# Altium project AFLC Board V1.PrjPcb
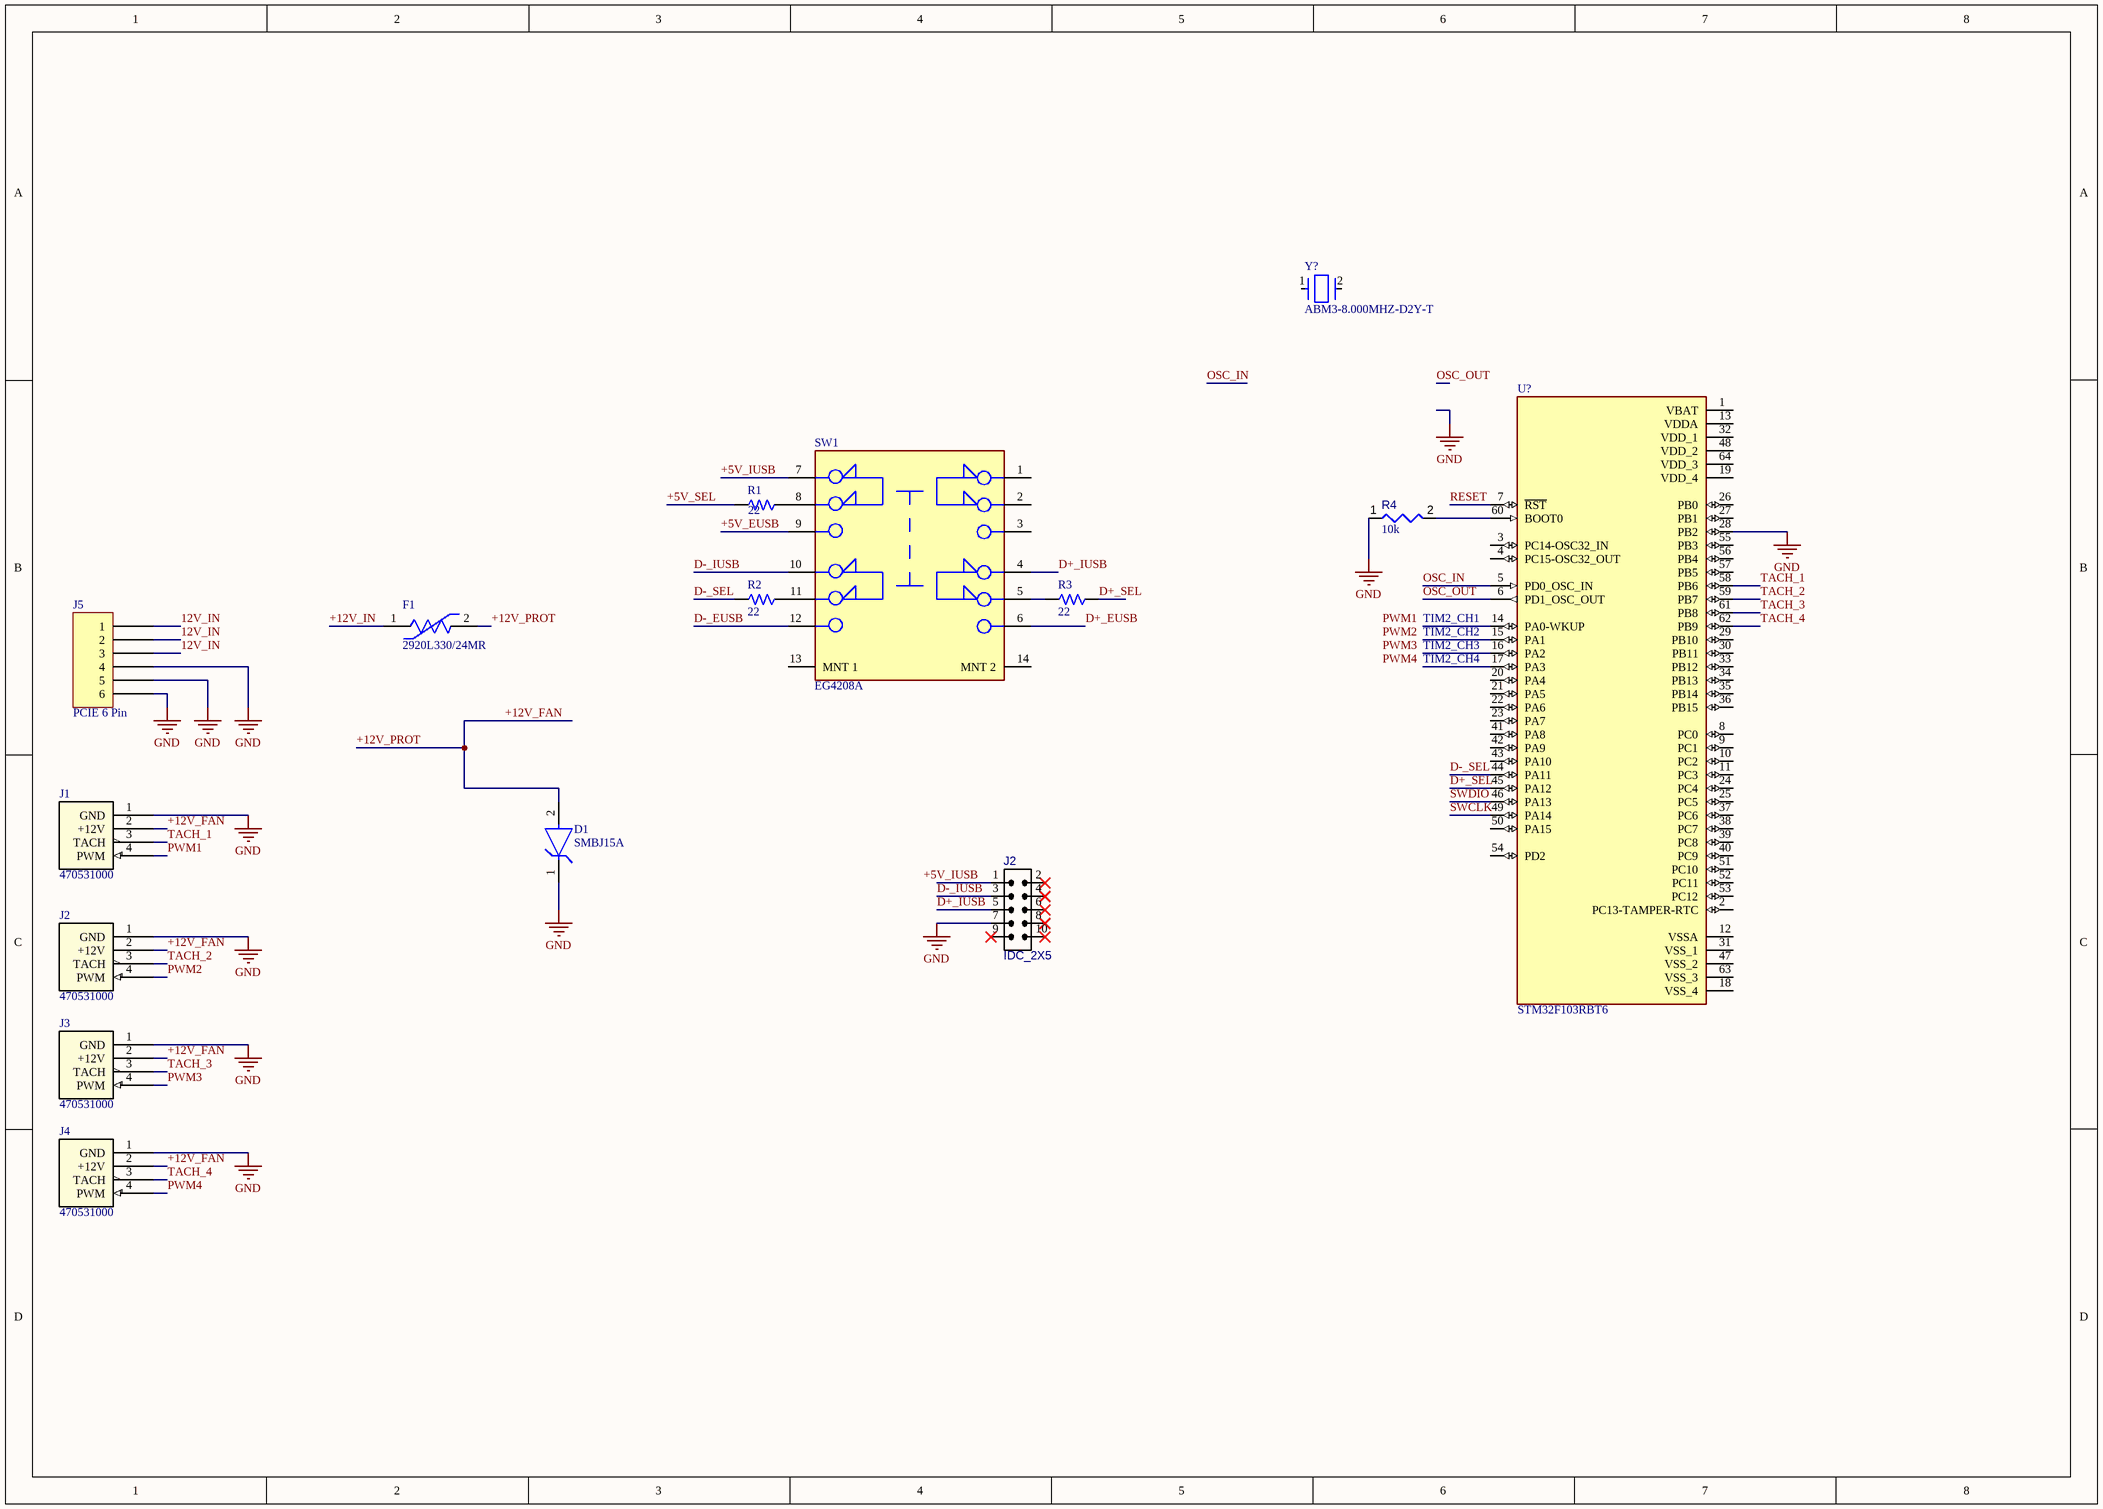
[diagram p0: 01-Power.SchDoc]
1 sheet, 15 parts. Net scope: global (net labels, ports and power ports of the same name join across sheets).

## Sheet 01-Power.SchDoc
size A3; SheetNumber: 1; SheetTotal: 1

### Parts
(Parts that share a designator on the sheet are numbered #1, #2 ... from top to bottom, then left to right.)
D1  SMBJ15A  [FP-SMBJ-MFG]
F1  2920L330/24MR  [FP-2920L-MFG]
J1  470531000  [CONN_SD-47053-001_H10p00_MOL]
J2#1  IDC_2X5  [IDC_2X5]
J2#2  470531000  [CONN_SD-47053-001_H10p00_MOL]
J3  470531000  [CONN_SD-47053-001_H10p00_MOL]
J4  470531000  [CONN_SD-47053-001_H10p00_MOL]
J5  PCIE 6 Pin  [MOLX-39-28-1063_V]
R1  value 22  (hidden comment: 1206W4F220JT5E)
R2  value 22  (hidden comment: 1206W4F220JT5E)
R3  value 22  (hidden comment: 1206W4F220JT5E)
R4  value 10k  [RESC0402(1005)_L]  (hidden comment: Resistor 10R  +/-1 % 0402 63 mW)
SW1  EG4208A  [FP-EG4208A-MFG]
U?  STM32F103RBT6  [QFP50P1200X1200X160-64N]
Y?  ABM3-8.000MHZ-D2Y-T  [FP-ABM3-MFG]

### Nets
GND: D1.1(C) J1.1(GND) J2#1.7 J2#2.1(GND) J3.1(GND) J4.1(GND) J5.4 J5.5 J5.6 R4.1 U?.28(PB2)
12V_IN: J5.1 J5.2 J5.3
+5V_EUSB: SW1.9
+5V_IUSB: SW1.7
+5V_SEL: R1.1
+12V_FAN: D1.2(A) F1.2 J1.2(+12V) J2#2.2(+12V) J3.2(+12V) J4.2(+12V)  [also labelled +12V_PROT]
+12V_IN: F1.1
D+_EUSB: SW1.6
D+_IUSB: J2#1.5 SW1.4
D+_SEL: R3.2 U?.45(PA12)
D-_EUSB: SW1.12
D-_IUSB: J2#1.3 SW1.10
D-_SEL: R2.1 U?.44(PA11)
OSC_IN: U?.5(PD0_OSC_IN)
OSC_OUT: U?.6(PD1_OSC_OUT)
PWM1: J1.4(PWM)
PWM2: J2#2.4(PWM)
PWM3: J3.4(PWM)
PWM4: J4.4(PWM)
RESET: U?.7(~{RST})
SWCLK: U?.49(PA14)
SWDIO: U?.46(PA13)
TACH_1: J1.3(TACH) U?.58(PB6)
TACH_2: J2#2.3(TACH) U?.59(PB7)
TACH_3: J3.3(TACH) U?.61(PB8)
TACH_4: J4.3(TACH) U?.62(PB9)
NetR1_2: R1.2 SW1.8
NetR2_2: R2.2 SW1.11
NetR3_1: R3.1 SW1.5
NetR4_2: R4.2 U?.60(BOOT0)

Not connected (* = marked no-connect by the designer): J2#1 1 2* 4* 6* 8* 9* 10*; SW1 1 2 3 13(MNT_1) 14(MNT_2); U? 1(VBAT) 2(PC13-TAMPER-RTC) 3(PC14-OSC32_IN) 4(PC15-OSC32_OUT) 8(PC0) 9(PC1) 10(PC2) 11(PC3) 12(VSSA) 13(VDDA) 14(PA0-WKUP) 15(PA1) 16(PA2) 17(PA3) 18(VSS_4) 19(VDD_4) 20(PA4) 21(PA5) 22(PA6) 23(PA7) 24(PC4) 25(PC5) 26(PB0) 27(PB1) 29(PB10) 30(PB11) 31(VSS_1) 32(VDD_1) 33(PB12) 34(PB13) 35(PB14) 36(PB15) 37(PC6) 38(PC7) 39(PC8) 40(PC9) 41(PA8) 42(PA9) 43(PA10) 47(VSS_2) 48(VDD_2) 50(PA15) 51(PC10) 52(PC11) 53(PC12) 54(PD2) 55(PB3) 56(PB4) 57(PB5) 63(VSS_3) 64(VDD_3); Y? 1 2

### Notes on the sheet
- (near U?) TIM2_CH1
- (near U?) TIM2_CH2
- (near U?) TIM2_CH3
- (near U?) TIM2_CH4
- Labels drawn without touching a wire or pin: +5V_IUSB, PWM1, PWM2, PWM3, PWM4

### Library data of the parts
D1 = CMP-07401-000033-1: TVS DIODE 15VWM 24.4VC SMB; Max Breakdown Voltage: 19.2V; Reverse Standoff Voltage: 15V; Number of Elements: 1; Diode Type: ZENER; Max Reverse Leakage Current: 5uA; Operating Supply Voltage: 3.5V; Element Configuration: Single; Reverse Breakdown Voltage: 16.7V; Peak Pulse Power: 600W; Peak Pulse Current: 24A; Polarity: Unidirectional; Clamping Voltage: 24.4V; ESD Protection: Yes; Test Current: 1mA; Power Line Protection: No; Max Surge Current: 100A; Min Operating Temperature: -55°C; Number of Pins: 2; Case/Package: DO-214AA; Number of Channels: 1; Series: SMBJ; Height: 2.42mm; Resistor Type: Zener; Max Power Dissipation: 600W; REACH SVHC: No SVHC; Package Quantity: 1; Breakdown Voltage: 19.2V; Radiation Hardening: No; Direction: Unidirectional; Number of Unidirectional Channels: 1; Termination: SMD/SMT; Length: 4.57mm; Width: 3.94mm; Packaging: Tape and Reel; Leakage Current: 5uA; RoHS Compliant: Yes; Mount: Surface Mount; Min Breakdown Voltage: 16.7V; Max Operating Temperature: 150°C
F1 = CMP-08606-000040-1: PTC RESET FUSE 24V 3.3A 2920; Manufacturer: Littelfuse; Trip Current: 5.5A; Resistance: 0.015-0.055Ω; Trip Time: 5s; Value: 0.015-0.055Ω; Current Rating: 40A; Temperature Range High: +85°C; RoHS: TRUE; Temperature Range Low: -40°C; Hold Current: 3.3A; Package: 2920L; Voltage Rating: 24V; Device Class L1: Circuit Protection; Lead Free: Yes; Ambient Temperature Range Low: -40°C; ComponentLink2Description: Datasheet; Device Class L2: PTC Resettable Fuses; Manufacturer Part Number: 2920L330/24MR; Automotive: No; Ambient Temperature Range High: +85°C; Mouser Description: In a Pack of 5, Littelfuse 3.3A Resettable Surface Mount Fuse, 24V dc; ComponentLink2URL: https://www.littelfuse.com/~/media/electronics/datasheets/resettable_ptcs/littelfuse_ptc_2920l_datasheet.pdf.pdf; Height: 2mm; Digikey Description: PTC RESET FUSE 24V 3.3A 2920; Octopart: https://octopart.com/2920l330%2F24mr-littelfuse-75250825; Category: Fuse; Temperature: -40°C to +85°C; Device Class L3: unset
J1 J2#2 J3 J4 = FH_PWM: KK 254 Vertical Header, with Friction Lock, 4 Circuits, 3.50mm PC Tail Length, Bag; Manufacturer_Name: Molex Connector Corporation; Copyright: Copyright (C) 2025 Ultra Librarian. All rights reserved.; Manufacturer_Part_Number: 470531000; RefDes: RefDes; Type: Type; Supplier 1: Avnet; Supplier Part Number 1: 0470531000
J2#1 = CMP-002-00998-1: Source: Conn Header.SchLib; VALUE: IDC_2X5; Component Type: Standard; Pins: 10; Design Item ID: IDC_2X5
J5 = 6 Pin
R1-R3 = CMP-009-00550-1: Resistor, 22Ω, ±1%, 250mW, 200V, ±100ppm/℃, -55℃~+155℃, SMD 1206; Manufacturer: Uniroyal; Temperature Rating: -55℃~+155℃; Case/Package: 1206; Category: Resistors; Temperature Coefficient: ±100ppm/℃; JLCPCB Part Number: C17958; ComponentLink1URL: https://wmsc.lcsc.com/wmsc/upload/file/pdf/v2/lcsc/2206010145_UNI-ROYAL-Uniroyal-Elec-1206W4F220JT5E_C17958.pdf; Tolerance: 1%; ComponentLink1Description: Datasheet; Power Rating: 250mW; ComponentLink2Description: JLCPCB Part URL; JLCPCB Basic Part: Yes; Design Item ID: 1206W4F220JT5E; Source: jlcpcb_2024_10_resistors_basic.schlib; Voltage Rating: 200V; ComponentLink2URL: https://jlcpcb.com/partdetail/C17958
R4 = CMP-009-00152-3: Chip Resistor, 10 Ohms, +/-1 %, 63 mW, -55 to 155 degC, 0402; Tolerance: 1%; Power: 63mW; Pins: 2; Max Operating Temperature: 155°C; Min Operating Temperature: -55°C; Case/Package: 0402
SW1 = CMP-17877-000001-1: SWITCH SLIDE 4PDT 200MA 30V; Manufacturer: E-Switch; Contact Resistance: 200mΩ; Standoff Height: 0.7mm; Electromechanical Life: 10000Cycles; Automotive: No; Temperature Range Low: -20°C; Footprint Url: http://spec_sheets.e-switch.com/specs/P040281.pdf; Temperature: -20°C to +70°C; Device Class L1: Electromechanical; RoHS: TRUE; Temperature Range High: +70°C; Throw Configuration: 4PDT; ComponentLink2URL: https://www.e-switch.com/system/asset/product_line/data_sheet/119/EG.pdf; Mount: Through Hole; Height: 5.4mm; Device Class L3: Slide Switches; Category: Switch; Lead Free: Yes; Manufacturer Part Number: EG4208A; Package: EG4208A; Digikey Description: SWITCH SLIDE 4PDT 200MA 30V; Device Class L2: Switches; Mouser Description: Slide Switches 4P2T SIDE OP PC MNT; Octopart: https://octopart.com/eg4208a-e-switch-1221143; ComponentLink2Description: Datasheet
U? = STM32F103RBT6: ARMÂ® CortexÂ®-M3 STM32F1 Microcontroller IC 32-Bit 72MHz 128KB (128K x 8) FLASH 64-LQFP (10x10); MF: STMicroelectronics; Package: LQFP-64 STMicroelectronics; Price: None; Check_prices: https://www.snapeda.com/parts/STM32F103RBT6/STMicroelectronics/view-part/?ref=eda; Value: *; SnapEDA_Link: https://www.snapeda.com/parts/STM32F103RBT6/STMicroelectronics/view-part/?ref=snap; MP: STM32F103RBT6; Availability: In Stock; Purchase-URL: https://pricing.snapeda.com/search?q=STM32F103RBT6&ref=eda
Y? = CMP-2000-05033-2: Crystal 8MHz ±20ppm 18pF SMD-2 5mm x 3.2mm; Series Resistance: 500R; Frequency Stability: 30ppm; ESR (Equivalent Series Resistance): 140R; Load Capacitance: 18pF; Height: 0.051inch; Tolerance: 20ppm; Depth: 3.2mm; Max Operating Temperature: 85°C; Frequency: 8MHz; Termination: SMD/SMT; Lead Free: Lead Free; Number of Pins: 2; Width: 3.2mm; RoHS Compliant: Yes; Resistor Type: Ceramic; Length: 5mm; Mount: Surface Mount; Case/Package: CSMD; Package Quantity: 1000; Radiation Hardening: No; Min Operating Temperature: -40°C; Packaging: Tape and Reel; Frequency Tolerance: 20ppm